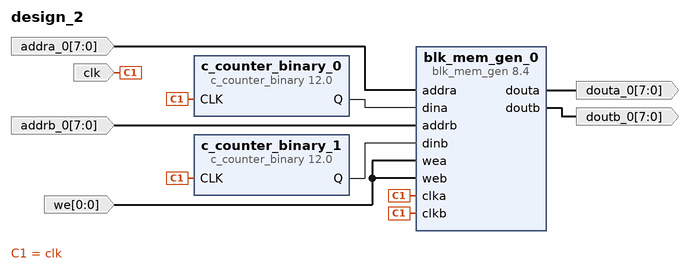
[diagram p0: block diagram of the top level]
# Vivado block design design_2, xc7a200tfbg676-2, Vivado 2024.1
create_bd_design design_2

create_bd_port -dir O -from 7 -to 0 doutb_0
create_bd_port -dir O -from 7 -to 0 douta_0
create_bd_port -dir I -from 7 -to 0 addrb_0
create_bd_port -dir I -from 0 -to 0 we
create_bd_port -dir I -from 7 -to 0 addra_0
create_bd_port -dir I -type clk clk

create_bd_cell -type ip -vlnv xilinx.com:ip:blk_mem_gen:8.4 blk_mem_gen_0
set_property -dict [list \
  CONFIG.Assume_Synchronous_Clk true \
  CONFIG.Enable_A Always_Enabled \
  CONFIG.Enable_B Always_Enabled \
  CONFIG.Memory_Type True_Dual_Port_RAM \
  CONFIG.Write_Depth_A 256 \
  CONFIG.Write_Width_A 8 \
  CONFIG.use_bram_block Stand_Alone \
] [get_bd_cells blk_mem_gen_0]
create_bd_cell -type ip -vlnv xilinx.com:ip:c_counter_binary:12.0 c_counter_binary_0
set_property -dict {CONFIG.CE false CONFIG.Increment_Value 2 CONFIG.Output_Width 8} [get_bd_cells c_counter_binary_0]
create_bd_cell -type ip -vlnv xilinx.com:ip:c_counter_binary:12.0 c_counter_binary_1
set_property -dict {CONFIG.CE false CONFIG.Output_Width 8} [get_bd_cells c_counter_binary_1]

# ---- connections ----

connect_bd_net -net addra_0_1 [get_bd_ports addra_0] [get_bd_pins blk_mem_gen_0/addra]
connect_bd_net -net addrb_0_1 [get_bd_ports addrb_0] [get_bd_pins blk_mem_gen_0/addrb]
connect_bd_net [get_bd_pins blk_mem_gen_0/douta] [get_bd_ports douta_0]
connect_bd_net [get_bd_pins blk_mem_gen_0/doutb] [get_bd_ports doutb_0]
connect_bd_net [get_bd_pins c_counter_binary_0/Q] [get_bd_pins blk_mem_gen_0/dina]
connect_bd_net [get_bd_pins c_counter_binary_1/Q] [get_bd_pins blk_mem_gen_0/dinb]
connect_bd_net -net clka_0_1 [get_bd_ports clk] \
  [get_bd_pins blk_mem_gen_0/clka] [get_bd_pins blk_mem_gen_0/clkb] [get_bd_pins c_counter_binary_0/CLK] \
  [get_bd_pins c_counter_binary_1/CLK]
connect_bd_net [get_bd_ports we] [get_bd_pins blk_mem_gen_0/web] [get_bd_pins blk_mem_gen_0/wea]

validate_bd_design
save_bd_design
